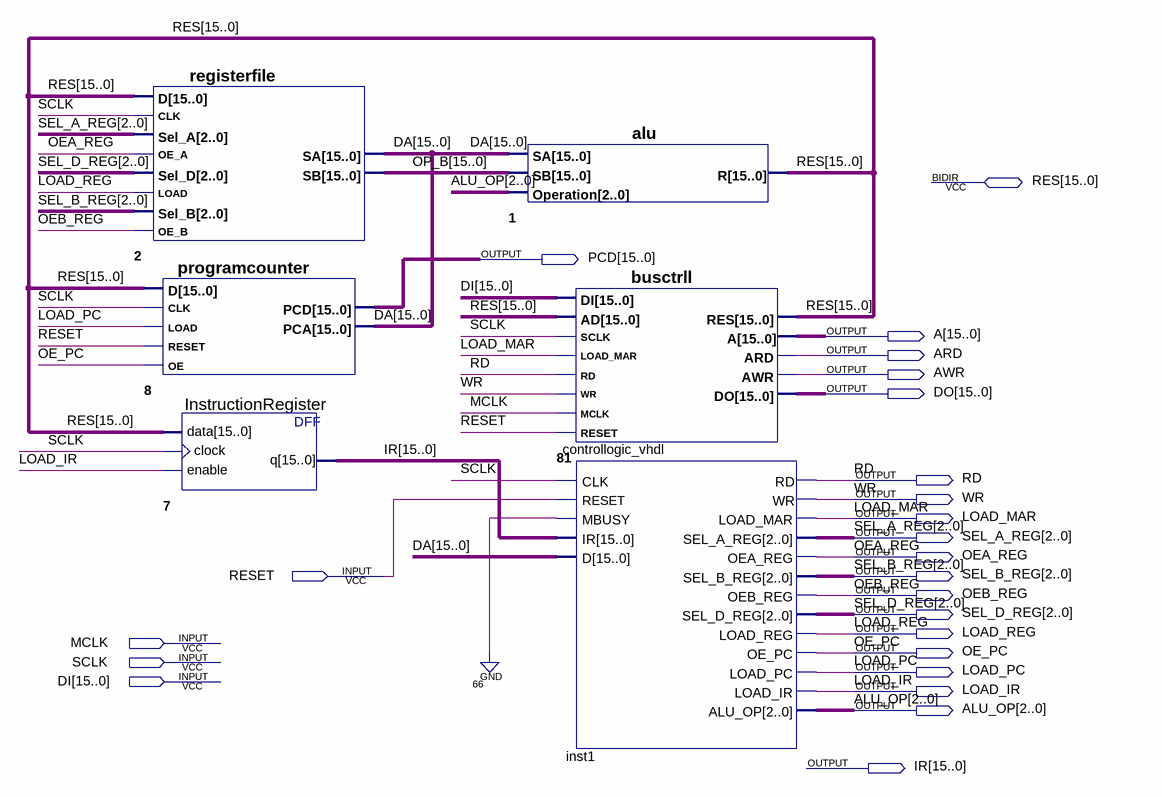
[diagram p0: schematic sheet]
// Quartus schematic cpu_top.bdf as structural Verilog: 6 symbols, 24 pins
module cpu_top (
  input  RESET,
  input  MCLK,
  input  SCLK,
  input  [15:0] DI,
  inout  [15:0] RES,
  output [15:0] PCD,
  output [15:0] A,
  output ARD,
  output AWR,
  output [15:0] DO,
  output RD,
  output WR,
  output LOAD_MAR,
  output [2:0] SEL_A_REG,
  output OEA_REG,
  output [2:0] SEL_B_REG,
  output OEB_REG,
  output [2:0] SEL_D_REG,
  output LOAD_REG,
  output OE_PC,
  output LOAD_PC,
  output LOAD_IR,
  output [2:0] ALU_OP,
  output [15:0] IR
);

  wire [15:0] DA, OP_B;

  registerfile u_2 (
    .D(RES), .CLK(SCLK), .Sel_A(SEL_A_REG), .OE_A(OEA_REG), .Sel_D(SEL_D_REG), .LOAD(LOAD_REG),
    .Sel_B(SEL_B_REG), .OE_B(OEB_REG), .SA(DA), .SB(OP_B));
  programcounter u_8 (.D(RES), .CLK(SCLK), .LOAD(LOAD_PC), .RESET(RESET), .OE(OE_PC), .PCD(PCD), .PCA(DA));
  InstructionRegister u_7 (.data(RES), .clock(SCLK), .enable(LOAD_IR), .q(IR));
  alu u_1 (.SA(DA), .SB(OP_B), .Operation(ALU_OP), .R(RES));
  busctrll u_81 (
    .DI(DI), .AD(RES), .SCLK(SCLK), .LOAD_MAR(LOAD_MAR), .RD(RD), .WR(WR), .MCLK(MCLK), .RESET(RESET),
    .RES(RES), .A(A), .ARD(ARD), .AWR(AWR), .DO(DO));
  controllogic_vhdl inst1 (
    .CLK(SCLK), .RESET(RESET), .MBUSY(1'b0), .IR(IR), .D(DA), .RD(RD), .WR(WR), .LOAD_MAR(LOAD_MAR),
    .SEL_A_REG(SEL_A_REG), .OEA_REG(OEA_REG), .SEL_B_REG(SEL_B_REG), .OEB_REG(OEB_REG),
    .SEL_D_REG(SEL_D_REG), .LOAD_REG(LOAD_REG), .OE_PC(OE_PC), .LOAD_PC(LOAD_PC), .LOAD_IR(LOAD_IR),
    .ALU_OP(ALU_OP));
endmodule
